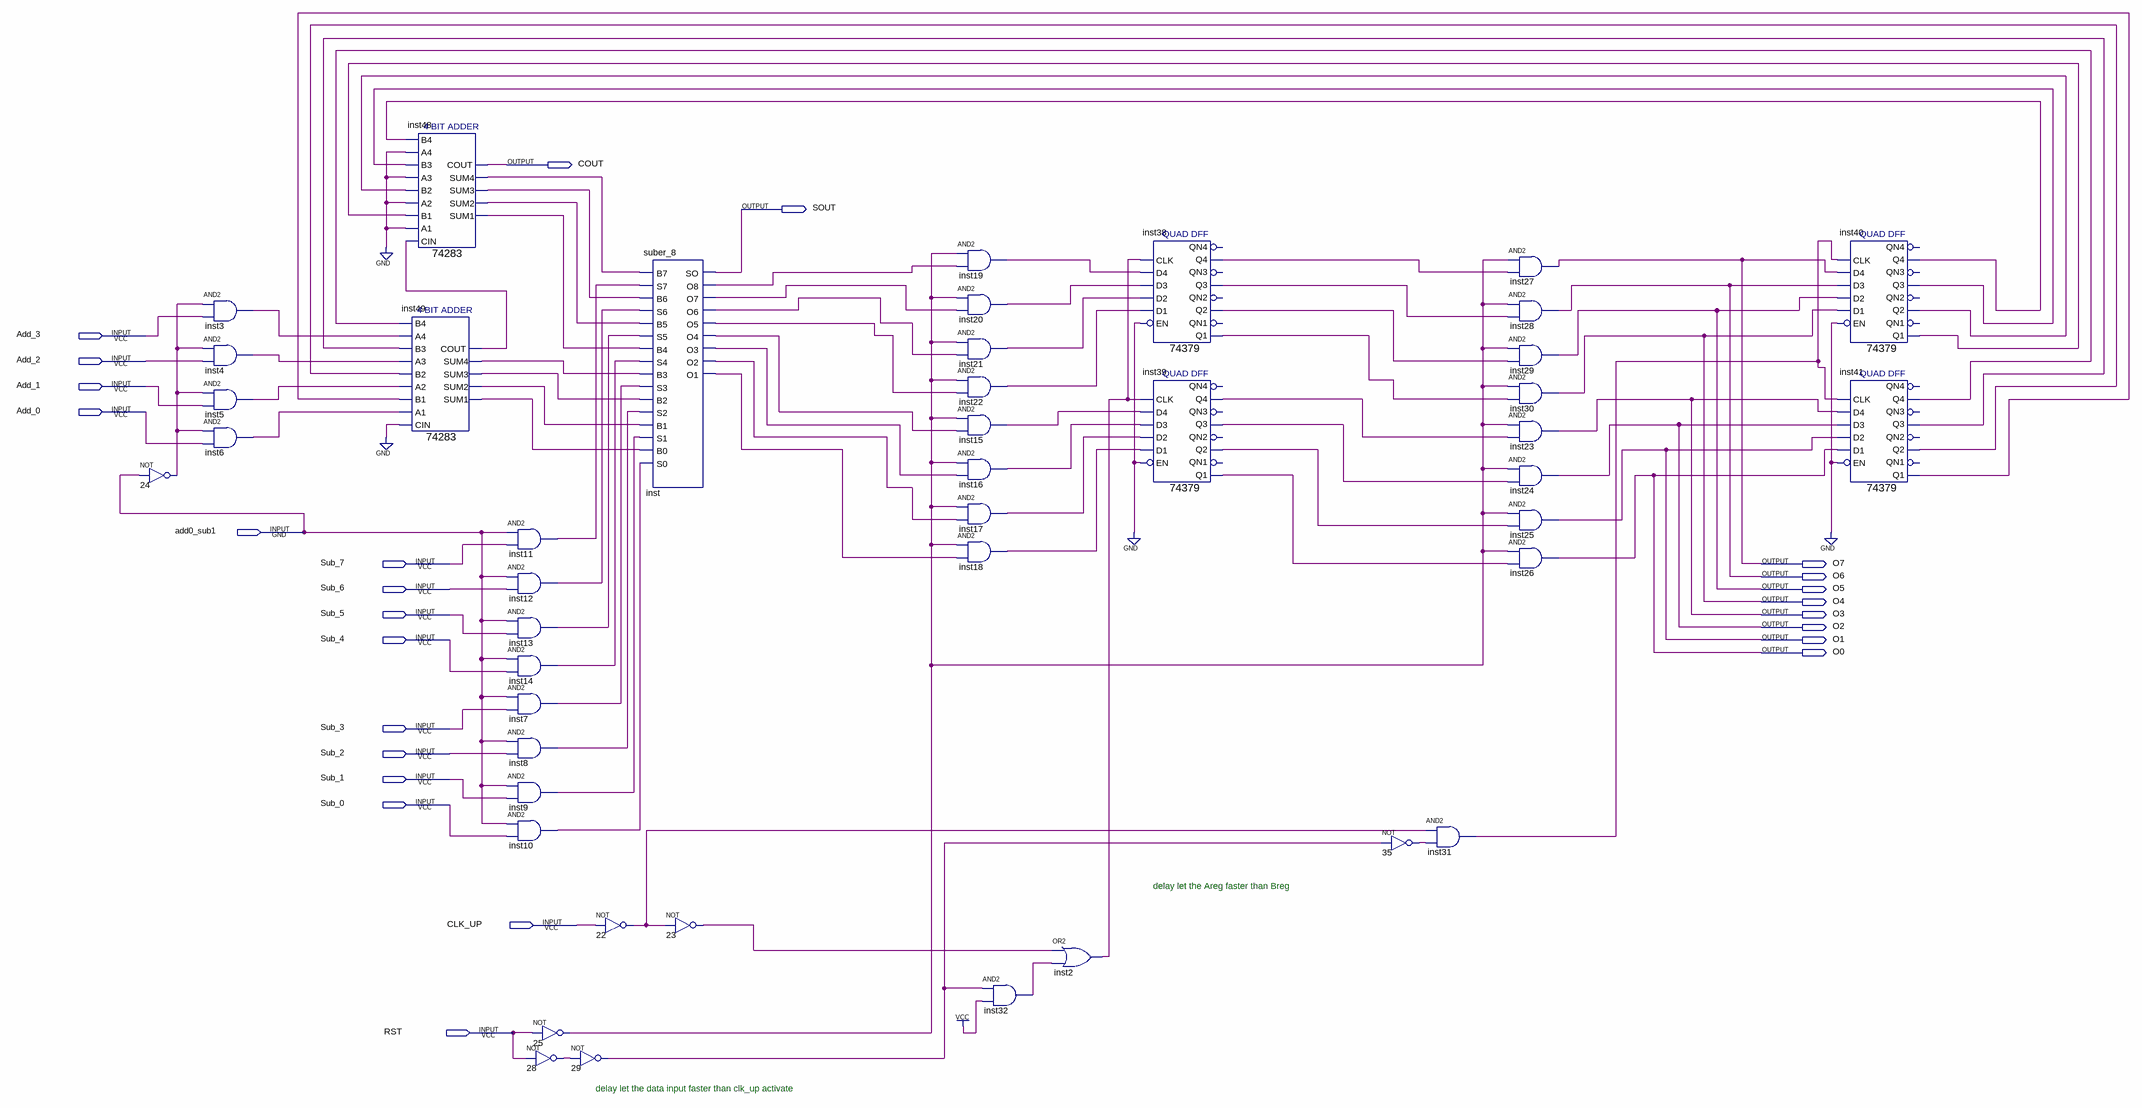
[diagram p0: schematic sheet]
// Quartus schematic self_add.bdf as structural Verilog: 45 symbols, 25 pins
module self_add (
  input  Add_3,
  input  Add_2,
  input  Add_1,
  input  Add_0,
  input  add0_sub1,
  input  Sub_7,
  input  Sub_6,
  input  Sub_5,
  input  Sub_4,
  input  Sub_3,
  input  Sub_2,
  input  Sub_1,
  input  Sub_0,
  input  CLK_UP,
  input  RST,
  output COUT,
  output SOUT,
  output O7,
  output O6,
  output O5,
  output O4,
  output O3,
  output O2,
  output O1,
  output O0
);

  wire inst2_out, inst3_out, inst4_out, inst5_out, inst6_out, inst7_out, inst8_out, inst9_out, inst10_out,
       inst11_out, inst12_out, inst13_out, inst14_out, inst15_out, inst16_out, inst17_out, inst18_out,
       inst19_out, inst20_out, inst21_out, inst22_out, inst31_out, inst32_out, inst38_q1, inst38_q2,
       inst38_q3, inst38_q4, inst39_q1, inst39_q2, inst39_q3, inst39_q4, inst40_q1, inst40_q2, inst40_q3,
       inst40_q4, inst41_q1, inst41_q2, inst41_q3, inst41_q4, inst48_sum1, inst48_sum2, inst48_sum3,
       inst48_sum4, inst49_cout, inst49_sum1, inst49_sum2, inst49_sum3, inst49_sum4, inst_o1, inst_o2,
       inst_o3, inst_o4, inst_o5, inst_o6, inst_o7, inst_o8, n22_out, n23_out, n24_out, n25_out, n28_out,
       n29_out, n35_out;

  not u_24 (n24_out, add0_sub1);
  and inst3 (inst3_out, n24_out, Add_3);
  and inst4 (inst4_out, n24_out, Add_2);
  and inst5 (inst5_out, n24_out, Add_1);
  and inst6 (inst6_out, n24_out, Add_0);
  \74283  inst48 (
    .CIN(inst49_cout), .A1(1'b0), .A2(1'b0), .B2(inst40_q2), .A3(1'b0), .A4(1'b0), .B4(inst40_q4),
    .B1(inst40_q1), .B3(inst40_q3), .SUM4(inst48_sum4), .COUT(COUT), .SUM1(inst48_sum1), .SUM2(inst48_sum2),
    .SUM3(inst48_sum3));
  \74283  inst49 (
    .CIN(1'b0), .A1(inst6_out), .A2(inst5_out), .B2(inst41_q2), .A3(inst4_out), .A4(inst3_out),
    .B4(inst41_q4), .B1(inst41_q1), .B3(inst41_q3), .SUM4(inst49_sum4), .COUT(inst49_cout),
    .SUM1(inst49_sum1), .SUM2(inst49_sum2), .SUM3(inst49_sum3));
  and inst11 (inst11_out, add0_sub1, Sub_7);
  and inst12 (inst12_out, add0_sub1, Sub_6);
  and inst13 (inst13_out, add0_sub1, Sub_5);
  and inst14 (inst14_out, add0_sub1, Sub_4);
  and inst7 (inst7_out, add0_sub1, Sub_3);
  and inst8 (inst8_out, add0_sub1, Sub_2);
  and inst9 (inst9_out, add0_sub1, Sub_1);
  and inst10 (inst10_out, add0_sub1, Sub_0);
  not u_25 (n25_out, RST);
  not u_28 (n28_out, RST);
  not u_22 (n22_out, CLK_UP);
  not u_29 (n29_out, n28_out);
  suber_8 inst (
    .B7(inst48_sum4), .S7(inst11_out), .B6(inst48_sum3), .S6(inst12_out), .B5(inst48_sum2), .S5(inst13_out),
    .B4(inst48_sum1), .S4(inst14_out), .B3(inst49_sum4), .S3(inst7_out), .B2(inst49_sum3), .S2(inst8_out),
    .B1(inst49_sum2), .S1(inst9_out), .B0(inst49_sum1), .S0(inst10_out), .SO(SOUT), .O8(inst_o8),
    .O7(inst_o7), .O6(inst_o6), .O5(inst_o5), .O4(inst_o4), .O3(inst_o3), .O2(inst_o2), .O1(inst_o1));
  not u_23 (n23_out, n22_out);
  and inst19 (inst19_out, n25_out, inst_o8);
  and inst20 (inst20_out, n25_out, inst_o7);
  and inst21 (inst21_out, n25_out, inst_o6);
  and inst22 (inst22_out, n25_out, inst_o5);
  and inst15 (inst15_out, n25_out, inst_o4);
  and inst16 (inst16_out, n25_out, inst_o3);
  and inst17 (inst17_out, n25_out, inst_o2);
  and inst18 (inst18_out, n25_out, inst_o1);
  and inst32 (inst32_out, n29_out, 1'b1);
  or inst2 (inst2_out, n23_out, inst32_out);
  \74379  inst38 (
    .D1(inst22_out), .EN(1'b0), .D2(inst21_out), .D3(inst20_out), .CLK(inst2_out), .D4(inst19_out),
    .Q4(inst38_q4), .Q3(inst38_q3), .Q2(inst38_q2), .Q1(inst38_q1));  // open: QN4, QN2, QN3, QN1
  \74379  inst39 (
    .D1(inst18_out), .EN(1'b0), .D2(inst17_out), .D3(inst16_out), .CLK(inst2_out), .D4(inst15_out),
    .Q4(inst39_q4), .Q3(inst39_q3), .Q2(inst39_q2), .Q1(inst39_q1));  // open: QN4, QN2, QN3, QN1
  not u_35 (n35_out, n29_out);
  and inst31 (inst31_out, n22_out, n35_out);
  and inst27 (O7, n25_out, inst38_q4);
  and inst28 (O6, n25_out, inst38_q3);
  and inst29 (O5, n25_out, inst38_q2);
  and inst30 (O4, n25_out, inst38_q1);
  and inst23 (O3, n25_out, inst39_q4);
  and inst24 (O2, n25_out, inst39_q3);
  and inst25 (O1, n25_out, inst39_q2);
  and inst26 (O0, n25_out, inst39_q1);
  \74379  inst40 (
    .D1(O4), .EN(1'b0), .D2(O5), .D3(O6), .CLK(inst31_out), .D4(O7), .Q4(inst40_q4), .Q3(inst40_q3),
    .Q2(inst40_q2), .Q1(inst40_q1));  // open: QN4, QN2, QN3, QN1
  \74379  inst41 (
    .D1(O0), .EN(1'b0), .D2(O1), .D3(O2), .CLK(inst31_out), .D4(O3), .Q4(inst41_q4), .Q3(inst41_q3),
    .Q2(inst41_q2), .Q1(inst41_q1));  // open: QN4, QN2, QN3, QN1

  // Notes on the sheet:
  //   delay let the Areg faster than Breg
  //   delay let the data input faster than clk_up activate
endmodule
